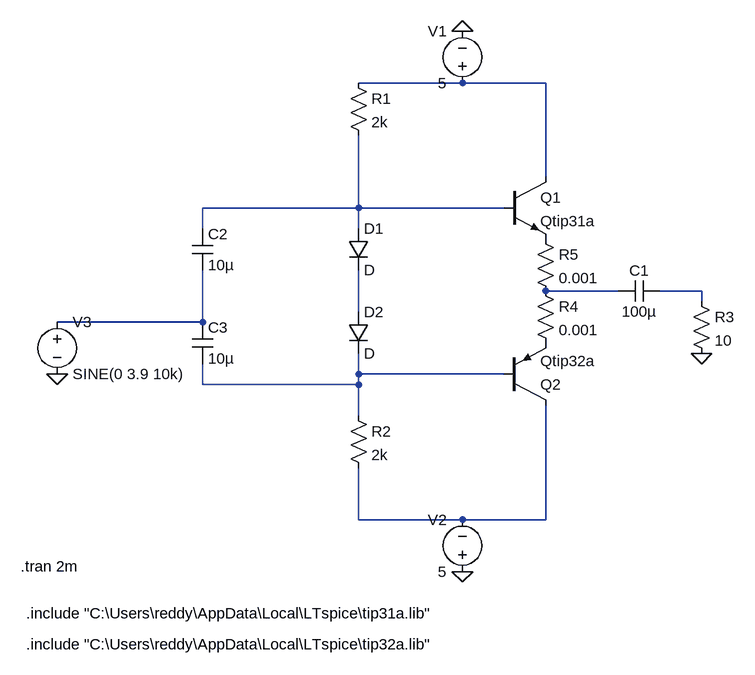
[diagram p0: schematic PowerAmp.asc]
PowerAmp.asc, the LTspice schematic file:
Version 4
SHEET 1 880 736
WIRE 384 -144 224 -144
WIRE 512 -144 384 -144
WIRE 512 0 512 -144
WIRE 224 48 224 -64
WIRE 224 48 -16 48
WIRE 448 48 224 48
WIRE -16 80 -16 48
WIRE 224 80 224 48
WIRE 624 176 512 176
WIRE 752 176 688 176
WIRE 752 192 752 176
WIRE 224 208 224 144
WIRE -16 224 -16 144
WIRE -16 224 -240 224
WIRE 224 304 224 272
WIRE 448 304 224 304
WIRE -16 320 -16 288
WIRE 224 320 224 304
WIRE 224 320 -16 320
WIRE 224 368 224 320
WIRE 224 528 224 448
WIRE 384 528 224 528
WIRE 512 528 512 352
WIRE 512 528 384 528
FLAG 752 272 0
FLAG 384 -224 0
FLAG 384 608 0
FLAG -240 304 0
SYMBOL res 208 -160 R0
SYMATTR InstName R1
SYMATTR Value 2k
SYMBOL res 208 352 R0
SYMATTR InstName R2
SYMATTR Value 2k
SYMBOL npn 448 0 R0
SYMATTR InstName Q1
SYMATTR Value Qtip31a
SYMBOL cap 688 160 R90
WINDOW 0 0 32 VBottom 2
WINDOW 3 32 32 VTop 2
SYMATTR InstName C1
SYMATTR Value 100µ
SYMBOL res 736 176 R0
SYMATTR InstName R3
SYMATTR Value 10
SYMBOL res 496 160 R0
SYMATTR InstName R4
SYMATTR Value 0.001
SYMBOL res 496 80 R0
SYMATTR InstName R5
SYMATTR Value 0.001
SYMBOL diode 208 80 R0
SYMATTR InstName D1
SYMBOL diode 208 208 R0
SYMATTR InstName D2
SYMBOL pnp 448 352 M180
SYMATTR InstName Q2
SYMATTR Value Qtip32a
SYMBOL cap -32 80 R0
SYMATTR InstName C2
SYMATTR Value 10µ
SYMBOL cap -32 224 R0
SYMATTR InstName C3
SYMATTR Value 10µ
SYMBOL voltage 384 -128 R180
WINDOW 0 24 96 Left 2
WINDOW 3 24 16 Left 2
WINDOW 123 0 0 Left 0
WINDOW 39 0 0 Left 0
SYMATTR InstName V1
SYMATTR Value 5
SYMBOL voltage 384 624 R180
WINDOW 0 24 96 Left 2
WINDOW 3 24 16 Left 2
WINDOW 123 0 0 Left 0
WINDOW 39 0 0 Left 0
SYMATTR InstName V2
SYMATTR Value 5
SYMBOL voltage -240 208 R0
WINDOW 123 0 0 Left 0
WINDOW 39 0 0 Left 0
SYMATTR InstName V3
SYMATTR Value SINE(0 3.9 10k)
TEXT -296 600 Left 2 !.tran 2m
TEXT -288 672 Left 2 !.include "C:\\Users\\reddy\\AppData\\Local\\LTspice\\tip31a.lib"
TEXT -288 720 Left 2 !.include "C:\\Users\\reddy\\AppData\\Local\\LTspice\\tip32a.lib"

The netlist it stands for:
* PowerAmp.asc
R1 N001 N002 2k
R2 N007 N008 2k
Q1 N001 N002 P001 0 Qtip31a
C1 N004 N003 100µ
R3 N004 0 10
R4 N003 P002 0.001
R5 P001 N003 0.001
D1 N002 N005 D
D2 N005 N007 D
Q2 N008 N007 P002 0 Qtip32a
C2 N002 N006 10µ
C3 N006 N007 10µ
V1 N001 0 5
V2 0 N008 5
V3 N006 0 SINE(0 3.9 10k)
.model D D
.lib standard.dio
.model NPN NPN
.model PNP PNP
.lib standard.bjt
.tran 2m
.include "C:\Users\reddy\AppData\Local\LTspice\tip31a.lib"
.include "C:\Users\reddy\AppData\Local\LTspice\tip32a.lib"
.backanno
.end